# Altium schematic sheet MCU.SchDoc: MCU
size A3; DocumentNumber: 2; SheetNumber: 2; SheetTotal: 5
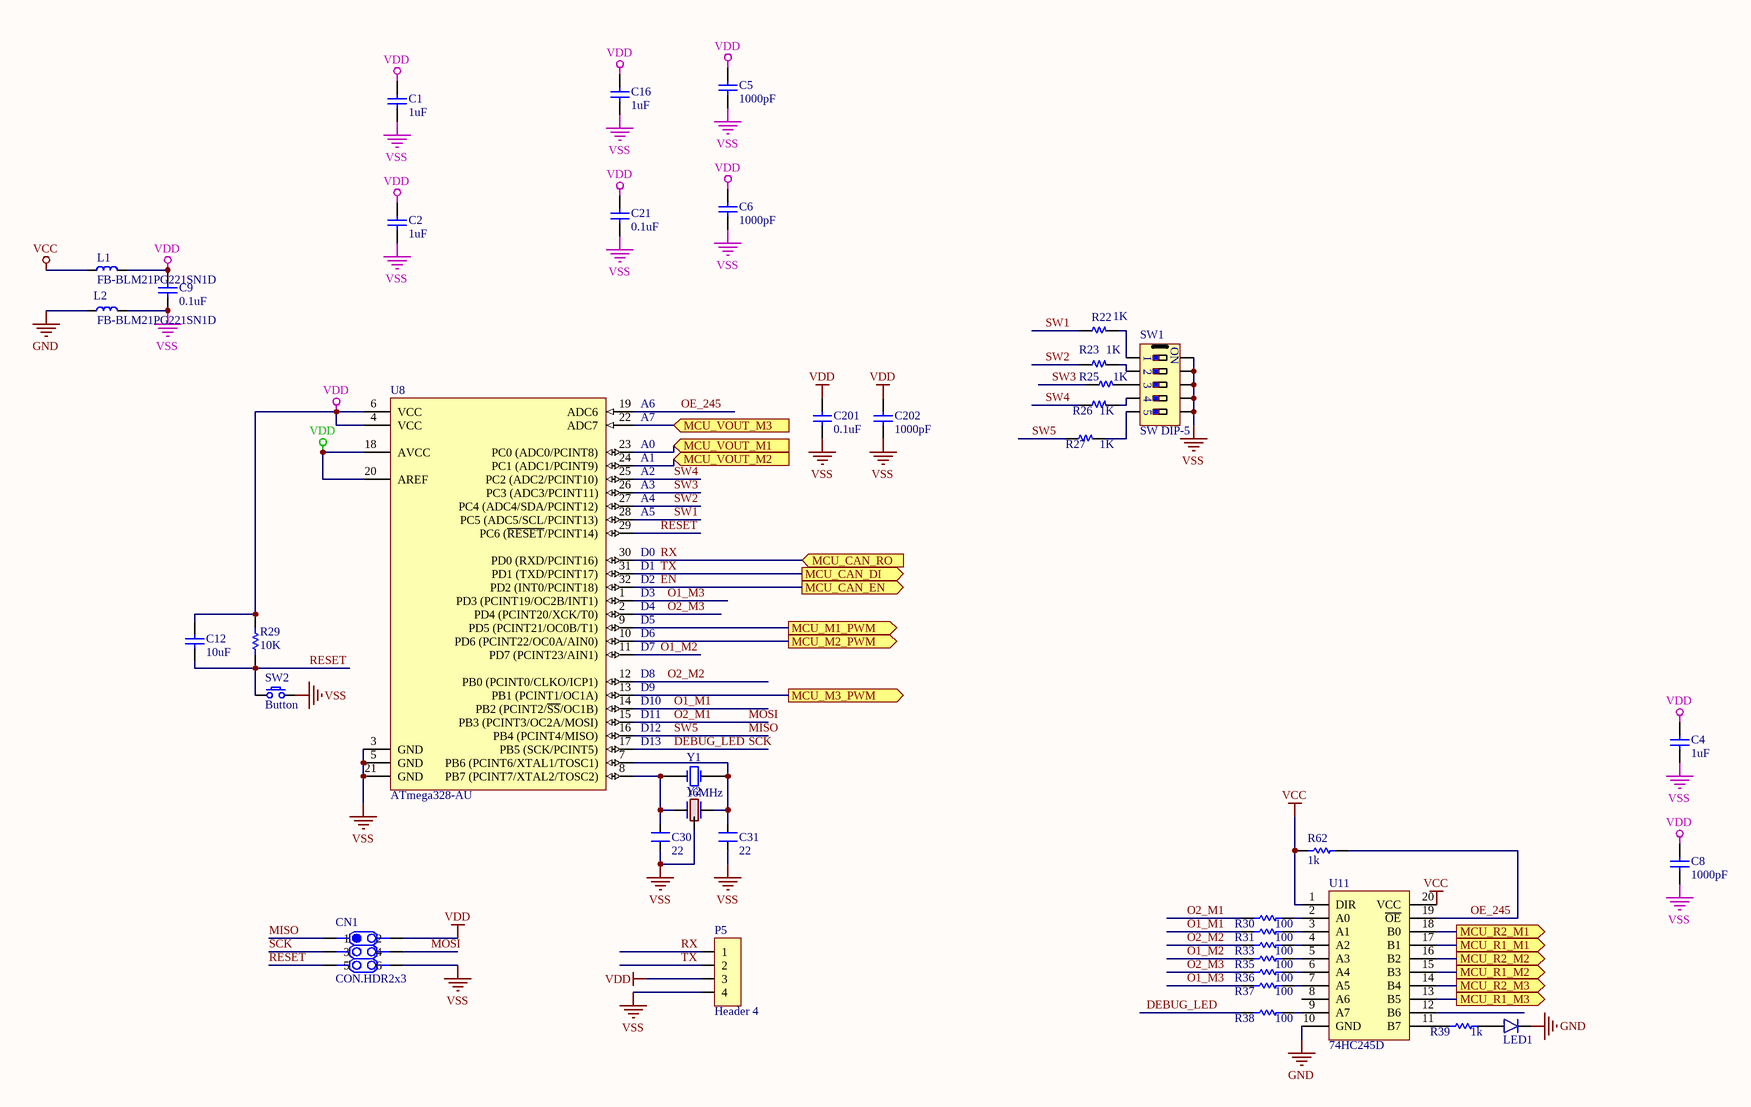
[diagram p0: MCU.SchDoc]

## Parts
C1  1uF  [C 0805 (2012)]
C2  1uF  [C 0805 (2012)]
C4  1uF  [C 0805 (2012)]
C5  1000pF  [C 0805 (2012)]
C6  1000pF  [C 0805 (2012)]
C8  1000pF  [C 0805 (2012)]
C9  0.1uF  [C 0805]
C12  10uF  [C 0805]
C16  1uF  [C 0805 (2012)]
C21  0.1uF  [C 0805 (2012)]
C30  22  [C 0805]
C31  22  [C 0805]
C201  0.1uF  [C 0805]
C202  1000pF  [C 0805]
CN1  CON.HDR2x3  [Header 3x2]
L1  FB-BLM21PG221SN1D  [L 0805 (2012)]
L2  FB-BLM21PG221SN1D  [L 0805 (2012)]
LED1  Led  [Led SMD 0805]  (value not drawn)
P5  Header 4  [Header 4]
R22  1K  [R 0805]
R23  1K  [R 0805]
R25  1K  [R 0805]
R26  1K  [R 0805]
R27  1K  [R 0805]
R29  10K  [R 0805]
R30  100  [R 0805]
R31  100  [R 0805]
R33  100  [R 0805]
R35  100  [R 0805]
R36  100  [R 0805]
R37  100  [R 0805]
R38  100  [R 0805]
R39  1k  [R 0805]
R62  1k  [R 0805]
SW1  SW DIP-5  [SW/DIP5/300]
SW2  Button  [SW/2/SMD]
U8  ATmega328-AU  [QFP32N]
U11  74HC245D  [SOIC-20]
Y1  16MHz  [XTAL]
Y2  (no value)  [Crystal SMD CSTCE]

## Ports
MCU_CAN_DI (out), MCU_CAN_EN (out), MCU_CAN_RO (in), MCU_M1_PWM (out), MCU_M2_PWM (out), MCU_M3_PWM (out), MCU_R1_M1 (out), MCU_R1_M2 (out), MCU_R1_M3 (out), MCU_R2_M1 (out), MCU_R2_M2 (out), MCU_R2_M3 (out), MCU_VOUT_M1 (in), MCU_VOUT_M2 (in), MCU_VOUT_M3 (in)

## Nets
GND: L2.1 LED1.2(K) U11.10(GND)
VCC: L1.1 R62.1 U11.1(DIR) U11.20(VCC)
VDD: C1.1 C2.1 C4.1 C5.1 C6.1 C8.1 C9.1 C12.1 C16.1 C21.1 C201.1 C202.1 CN1.2 L1.2 P5.3 R29.2 U8.4(VCC) U8.6(VCC) U8.18(AVCC) U8.20(AREF)
VSS: C1.2 C2.2 C4.2 C5.2 C6.2 C8.2 C9.2 C16.2 C21.2 C30.1 C31.1 C201.2 C202.2 CN1.6 L2.2 P5.4 SW1.6 SW1.7 SW1.8 SW1.9 SW1.10 SW2.2 U8.3(GND) U8.5(GND) U8.21(GND) Y2.2
DEBUG_LED: CN1.3 R38.1 U8.17(PB5_(SCK/PCINT5))  [also labelled SCK]
EN: U8.32(PD2_(INT0/PCINT18)) ; port MCU_CAN_EN
MCU_M1_PWM: U8.9(PD5_(PCINT21/OC0B/T1)) ; port MCU_M1_PWM
MCU_M2_PWM: U8.10(PD6_(PCINT22/OC0A/AIN0)) ; port MCU_M2_PWM
MCU_M3_PWM: U8.13(PB1_(PCINT1/OC1A)) ; port MCU_M3_PWM
MCU_R1_M1: U11.17(B1) ; port MCU_R1_M1
MCU_R1_M2: U11.15(B3) ; port MCU_R1_M2
MCU_R1_M3: U11.13(B5) ; port MCU_R1_M3
MCU_R2_M1: U11.18(B0) ; port MCU_R2_M1
MCU_R2_M2: U11.16(B2) ; port MCU_R2_M2
MCU_R2_M3: U11.14(B4) ; port MCU_R2_M3
MCU_VOUT_M1: U8.23(PC0_(ADC0/PCINT8)) ; port MCU_VOUT_M1
MCU_VOUT_M2: U8.24(PC1_(ADC1/PCINT9)) ; port MCU_VOUT_M2
MCU_VOUT_M3: U8.22(ADC7) ; port MCU_VOUT_M3
MISO: CN1.1 R27.1 U8.16(PB4_(PCINT4/MISO))  [also labelled SW5]
MOSI: CN1.4 R30.1 U8.15(PB3_(PCINT3/OC2A/MOSI))  [also labelled O2_M1]
O1_M1: R31.1 U8.14(PB2_(PCINT2/~{SS}/OC1B))
O1_M2: R35.1 U8.11(PD7_(PCINT23/AIN1))
O1_M3: R37.1 U8.1(PD3_(PCINT19/OC2B/INT1))
O2_M2: R33.1 U8.12(PB0_(PCINT0/CLKO/ICP1))
O2_M3: R36.1 U8.2(PD4_(PCINT20/XCK/T0))
OE_245: R62.2 U8.19(ADC6) U11.19(~{OE})
RESET: C12.2 CN1.5 R29.1 SW2.1 U8.29(PC6_(~{RESET}/PCINT14))
RX: P5.1 U8.30(PD0_(RXD/PCINT16)) ; port MCU_CAN_RO
SW1: R22.1 U8.28(PC5_(ADC5/SCL/PCINT13))
SW2: R23.1 U8.27(PC4_(ADC4/SDA/PCINT12))
SW3: R25.1 U8.26(PC3_(ADC3/PCINT11))
SW4: R26.1 U8.25(PC2_(ADC2/PCINT10))
TX: P5.2 U8.31(PD1_(TXD/PCINT17)) ; port MCU_CAN_DI
NetC30_2: C30.2 U8.8(PB7_(PCINT7/XTAL2/TOSC2)) Y1.1(OSC1) Y2.3
NetC31_2: C31.2 U8.7(PB6_(PCINT6/XTAL1/TOSC1)) Y1.2(OSC2) Y2.1
NetLED1_1: LED1.1(A) R39.2
NetR22_2: R22.2 SW1.1
NetR23_2: R23.2 SW1.2
NetR25_2: R25.2 SW1.3
NetR26_2: R26.2 SW1.4
NetR27_2: R27.2 SW1.5
NetR30_2: R30.2 U11.2(A0)
NetR31_2: R31.2 U11.3(A1)
NetR33_2: R33.2 U11.4(A2)
NetR35_2: R35.2 U11.5(A3)
NetR36_2: R36.2 U11.6(A4)
NetR37_2: R37.2 U11.7(A5)
NetR38_2: R38.2 U11.9(A7)
NetR39_1: R39.1 U11.11(B7)

Not connected (* = marked no-connect by the designer): U11 8(A6) 12(B6)

## Notes on the sheet
- (near U8) A6
- (near U8) A0
- (near U8) A1
- (near U8) A2
- (near U8) A7
- (near U8) A3
- (near U8) A4
- (near U8) A5
- (near U8) D2
- (near U8) D3
- (near U8) D4
- (near U8) D0
- (near U8) D1
- (near U8) D7
- (near U8) D8
- (near U8) D5
- (near U8) D6
- (near U8) D9
- (near U8) D10
- (near U8) D11
- D12
- D13
- Title
- Size:
- Date:
- Number:
- Time:
- Revision:
- Sheet
- of
- NPN
- Lab
- File:
- (in symbol SW DIP-5) ON

## Library data of the parts
C1 C2 C4-C6 C8 C12 C16 C21 C201 C202 = Capacitor NP: Capacitor non-pol
C9 = Capacitor NP: CAP CER 0.1UF 50V X7R 0603; TYPE: SMD; PACKAGE: SMD0603; STOCK CODE: CC0603KRX7R9BB104; SUPPLIER: tme.vn; STOCK DESC: 100nF/50V ±10% X7R SMD-0603 Capacitor; UNIT PRICE: 400
C30 C31 = CN2: Cap np 104 => 105pF; Value: 0.1uF
CN1 = CON.HDR2x3: Header 2x3; Publisher: Hoang Nguyen; ComponentLink1Description: Digikey Part link; ComponentLink2Description: Open DataSheet; ComponentLink2URL: H:\LIBRARY\LIBRARY.Datasheet\
L1 L2 = Inductor
LED1 = Led: Typical LED
P5 = Header 4: Header, 4-Pin
R22 R23 R25-R27 R29-R31 R33 R35-R39 R62 = Resistor
  R29: Published: 8-Jun-2000; LatestRevisionDate: 17-Jul-2002; LatestRevisionNote: Re-released for DXP Platform.; PackageReference: AXIAL-0.3; Publisher: Altium Limited; Value: 10K
  R30 R31 R33 R35-R39 R62: Published: 8-Jun-2000; LatestRevisionDate: 17-Jul-2002; LatestRevisionNote: Re-released for DXP Platform.; PackageReference: AXIAL-0.3; Publisher: Altium Limited
SW2 = SW SPST: Tact switch 2 pin
U8 = ATmega328-AU: 8-bit AVR Microcontroller, 32KB Flash, 1KB EEPROM, 2KB SRAM, 32-pin TQFP, Industrial Grade (-40°C to 85°C); Published: 1-Apr-2010; DatasheetVersion: revA, Jan-2010; PackageVersion: revB, Oct-2001; PackageReference: 32A; Publisher: Altium Limited; PackageDescription: 32-Lead, 7x7x1.0 mm Body, 0.8mm Lead Pitch, Thin Profile Plastic Quad Flat Package (TQFP); Supplier 1: Digi-Key; Supplier Part Number 1: ATMEGA328-AU-ND; Supplier 2: Mouser; Supplier Part Number 2: 556-ATMEGA328-AU; Code_JEDEC: MS-026-ABA; ComponentLink1Description: Manufacturer Link; ComponentLink1URL: http://www.atmel.com/products/avr/default.asp?; ComponentLink2Description: ATmega48A/48PA/88A/88PA/168A/168PA/328/328P Datasheet; ComponentLink2URL: http://www.atmel.com/dyn/resources/prod_documents/8271.pdf; ComponentLink3Description: ATmega48A/48PA/88A/88PA/168A/168PA/328/328P Summary; ComponentLink3URL: http://www.atmel.com/dyn/resources/prod_documents/8271S.pdf; ComponentLink4Description: Atmel.com Home; ComponentLink4URL: http://www.atmel.com
U11 = 74HC245D: IC TRANSCVR NON-INVERT 6V 20SO
Y1 = XTAL: Crystal Oscillator; Published: 8-Jun-2000; LatestRevisionDate: 17-Jul-2002; LatestRevisionNote: Re-released for DXP Platform.; PackageReference: R38; Publisher: Altium Limited
Y2 = Crystal CSTCE